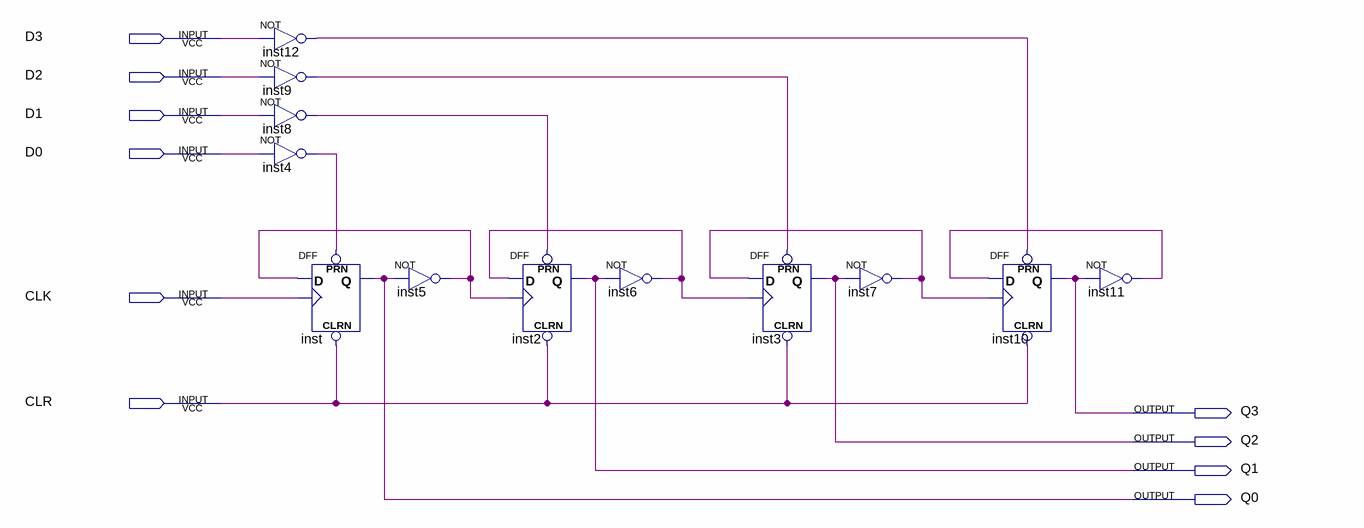
[diagram p0: schematic sheet]
// Quartus schematic ripple_counter_16_with_input.bdf as structural Verilog: 12 symbols, 10 pins
module ripple_counter_16_with_input (
  input  D3,
  input  D2,
  input  D1,
  input  D0,
  input  CLK,
  input  CLR,
  output Q3,
  output Q2,
  output Q1,
  output Q0
);

  wire inst4_out, inst5_out, inst6_out, inst7_out, inst8_out, inst9_out, inst11_out, inst12_out;

  not inst12 (inst12_out, D3);
  not inst9 (inst9_out, D2);
  not inst8 (inst8_out, D1);
  not inst4 (inst4_out, D0);
  DFF inst (.CLRN(CLR), .CLK(CLK), .D(inst5_out), .PRN(inst4_out), .Q(Q0));
  not inst5 (inst5_out, Q0);
  DFF inst2 (.CLRN(CLR), .CLK(inst5_out), .D(inst6_out), .PRN(inst8_out), .Q(Q1));
  not inst6 (inst6_out, Q1);
  DFF inst3 (.CLRN(CLR), .CLK(inst6_out), .D(inst7_out), .PRN(inst9_out), .Q(Q2));
  not inst7 (inst7_out, Q2);
  DFF inst10 (.CLRN(CLR), .CLK(inst7_out), .D(inst11_out), .PRN(inst12_out), .Q(Q3));
  not inst11 (inst11_out, Q3);
endmodule
